# Altium schematic sheet 1st file.SchDoc
size A; SheetNumber: 1; SheetTotal: 1
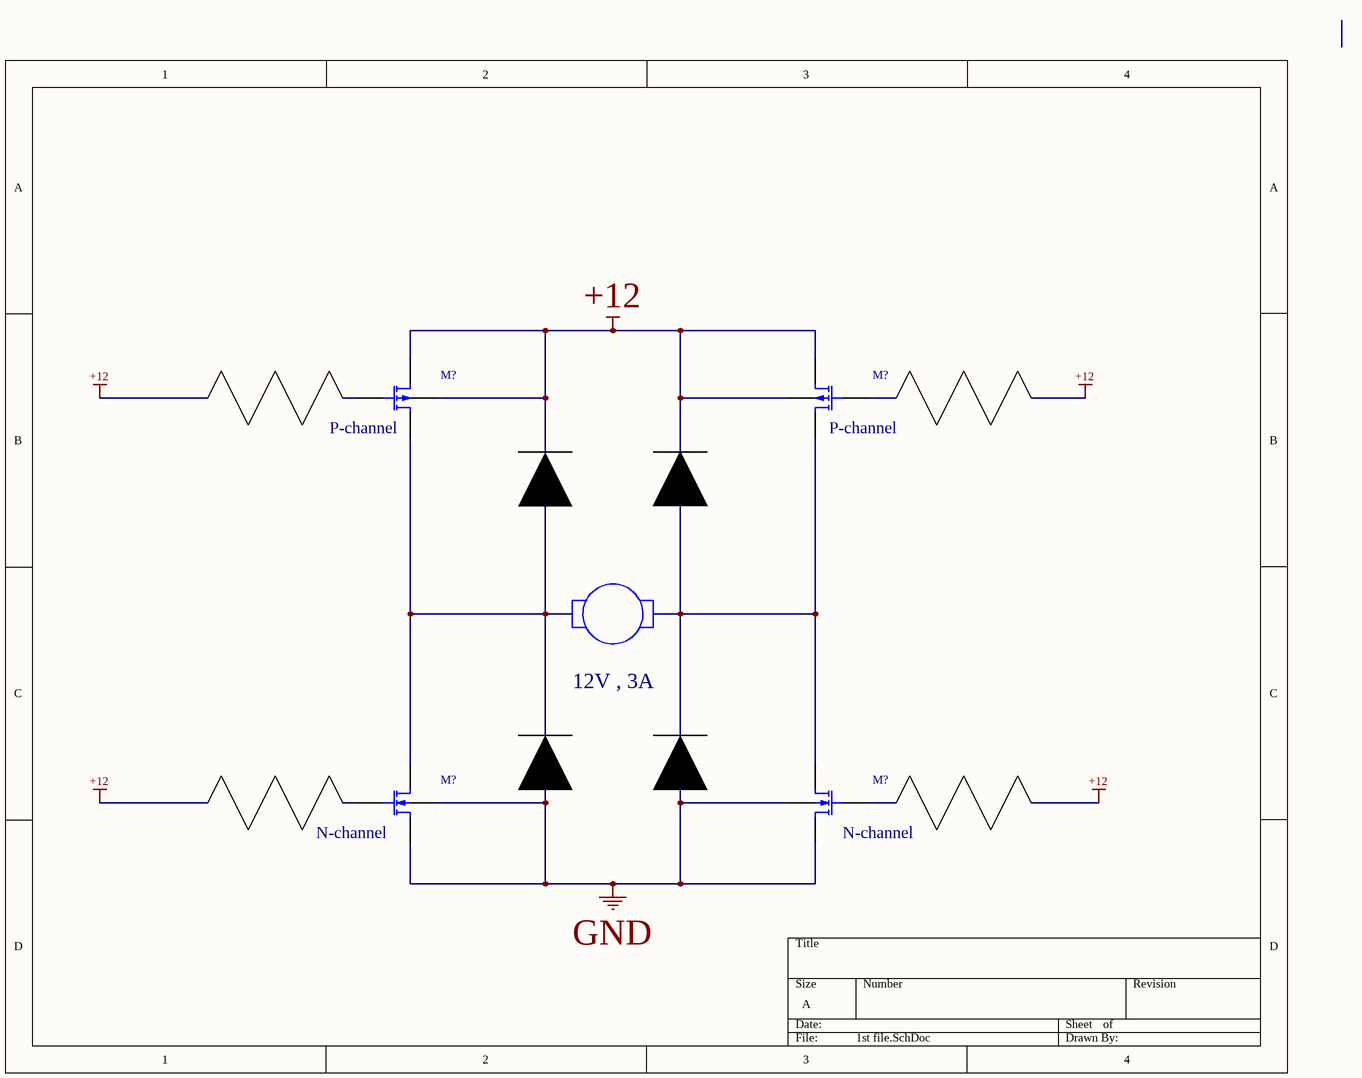
[diagram p0: 1st file.SchDoc]

## Parts
(Parts that share a designator on the sheet are numbered #1, #2 ... from top to bottom, then left to right.)
M?#1  P-channel MOS1 MOSFET Shichman and Hodges Model  (value not drawn)
M?#2  P-channel MOS1 MOSFET Shichman and Hodges Model  (value not drawn)
M?#3  N-channel MOS1 MOSFET Shichman and Hodges Model  (value not drawn)
M?#4  N-channel MOS1 MOSFET Shichman and Hodges Model  (value not drawn)

## Nets
+12: M?#1.1(D) M?#1.4(B) M?#2.3(S) M?#2.4(B)
GND: M?#3.3(S) M?#3.4(B) M?#4.1(D) M?#4.4(B)
NetM?#1_3: M?#1.3(S) M?#3.1(D)
NetM?#2_1: M?#2.1(D) M?#4.3(S)

Not connected (* = marked no-connect by the designer): M?#1 2(G); M?#2 2(G); M?#3 2(G); M?#4 2(G)

## Notes on the sheet
- (near M?#1) P-channel
- (near M?#2) P-channel
- 12V , 3A
- (near M?#3) N-channel
- (near M?#4) N-channel

## Library data of the parts
M?#1 M?#2 = MOSFET P-ch Lev1: CBD: 0; FC: 0.5; IS: 1e-14; KP: 2e-05; PB: 0.8; PHI: 0.6; TNOM: 27; SimulationGenericComponent: True; CBS: 0; CGBO: 0; CGDO: 0; CGSO: 0; CJ: 0; CJSW: 0; GAMMA: 0; JS: 0; LAMBDA: 0; LD: 0; MJ: 0.5; MJSW: 0.5; NSS: 0; NSUB: 0; RD: 0; RS: 0; RSH: 0; TOX: 0; TPG: 0; U0: 0; VTO: 0
M?#3 M?#4 = MOSFET N-ch Lev1: CBD: 0; FC: 0.5; IS: 1e-14; KP: 2e-05; PB: 0.8; PHI: 0.6; TNOM: 27; SimulationGenericComponent: True; CBS: 0; CGBO: 0; CGDO: 0; CGSO: 0; CJ: 0; CJSW: 0; GAMMA: 0; JS: 0; LAMBDA: 0; LD: 0; MJ: 0.5; MJSW: 0.5; NSS: 0; NSUB: 0; RD: 0; RS: 0; RSH: 0; TOX: 0; TPG: 0; U0: 0; VTO: 0